# EAGLE design TwoArmedBandit_v1 (EAGLE 9.6.2)
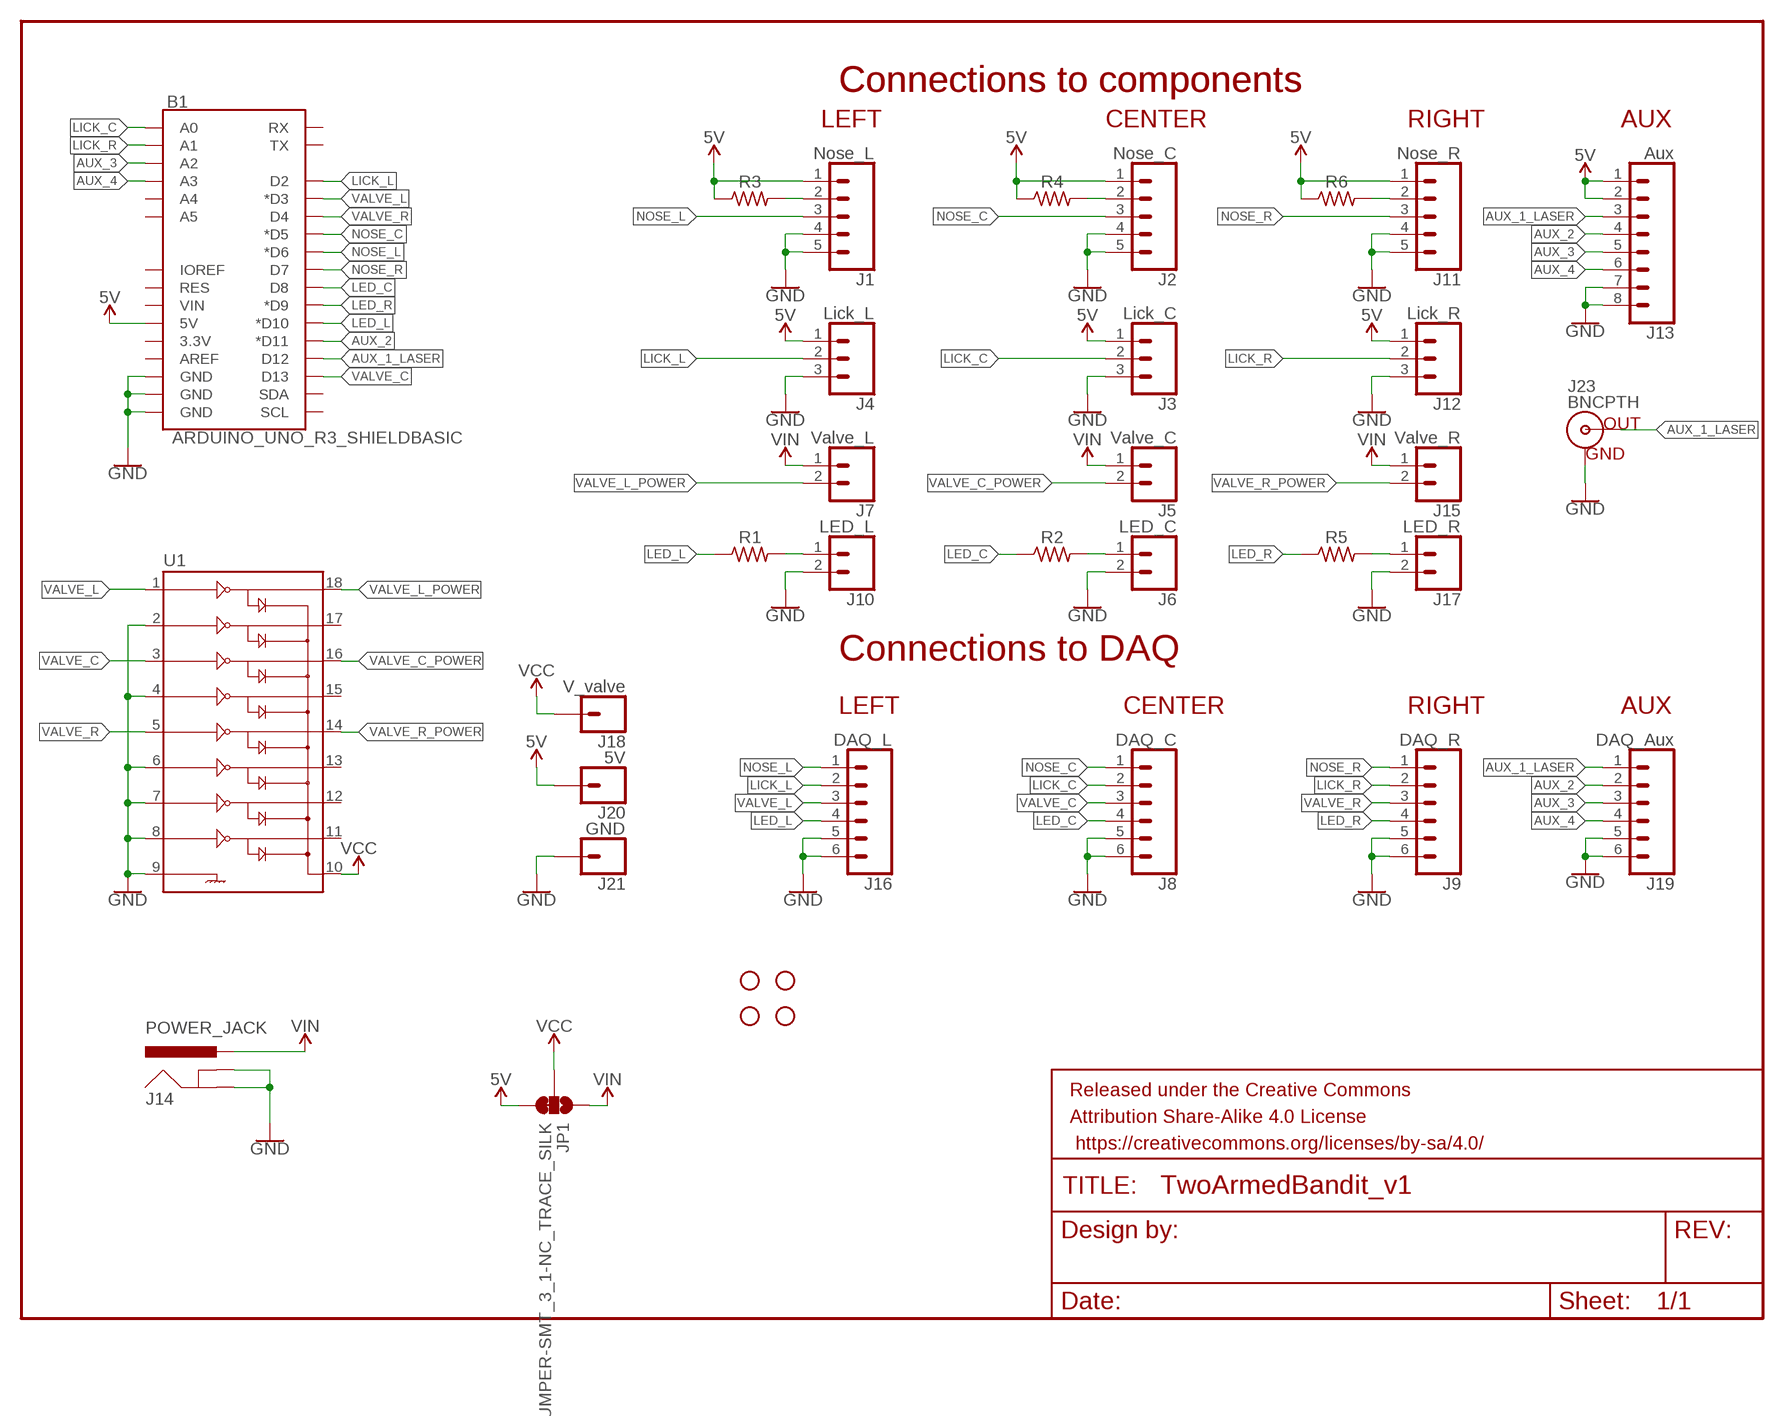
[diagram p0: schematic, sheet 1]

## Parts
B1  ARDUINO_UNO_R3_SHIELDBASIC  [UNO_R3_SHIELD]
FRAME1  FRAME-LETTERNO_PACKAGE  [DUMMY]
H1  STAND-OFF  [STAND-OFF]
H2  STAND-OFF  [STAND-OFF]
H3  STAND-OFF  [STAND-OFF]
H4  STAND-OFF  [STAND-OFF]
J1  Nose_L  CONN_05SCREW  [SCREWTERMINAL-3.5MM-5]
J2  Nose_C  CONN_05SCREW  [SCREWTERMINAL-3.5MM-5]
J3  Lick_C  CONN_03  [1X03]
J4  Lick_L  CONN_03  [1X03]
J5  Valve_C  CONN_02  [1X02]
J6  LED_C  CONN_02  [1X02]
J7  Valve_L  CONN_02  [1X02]
J8  DAQ_C  CONN_063.5MM-6  [SCREWTERMINAL-3.5MM-6]
J9  DAQ_R  CONN_063.5MM-6  [SCREWTERMINAL-3.5MM-6]
J10  LED_L  CONN_02  [1X02]
J11  Nose_R  CONN_05SCREW  [SCREWTERMINAL-3.5MM-5]
J12  Lick_R  CONN_03  [1X03]
J13  Aux  CONN_08"  [1X08]
J14  POWER_JACK  [POWER_JACK_PTH]
J15  Valve_R  CONN_02  [1X02]
J16  DAQ_L  CONN_063.5MM-6  [SCREWTERMINAL-3.5MM-6]
J17  LED_R  CONN_02  [1X02]
J18  V_valve  CONN_01PTH_2MM  [1X01_2MM]
J19  DAQ_Aux  CONN_063.5MM-6  [SCREWTERMINAL-3.5MM-6]
J20  5V  CONN_01PTH_2MM  [1X01_2MM]
J21  GND  CONN_01PTH_2MM  [1X01_2MM]
J23  BNCPTH  [BNC]
JP1  JUMPER-SMT_3_1-NC_TRACE_SILK  [SMT-JUMPER_3_1-NC_TRACE_SILK]
R1  330  R-US_0309/12  [0309/12]
R2  330  R-US_0309/12  [0309/12]
R3  160  R-US_0309/12  [0309/12]
R4  160  R-US_0309/12  [0309/12]
R5  330  R-US_0309/12  [0309/12]
R6  160  R-US_0309/12  [0309/12]
U1  ULN2803DIP  [DIL18]

## Nets
5V [power]: B1.5V J1.1 J2.1 J3.1 J4.1 J11.1 J12.1 J13.1 J13.2 J20.1 JP1.3 R3.1 R4.1 R6.1
AUX_1_LASER: B1.D12 J13.3 J19.1 J23.S(OUT)
AUX_2: B1.D11(*D11) J13.4 J19.2
AUX_3: B1.A2 J13.5 J19.3
AUX_4: B1.A3 J13.6 J19.4
GND [power]: B1.GND@0(GND) B1.GND@1(GND) B1.GND@2(GND) J1.4 J1.5 J2.4 J2.5 J3.3 J4.3 J6.2 J8.5 J8.6 J9.5 J9.6 J10.2 J11.4 J11.5 J12.3 J13.7 J13.8 J14.GND J14.GNDBREAK J16.5 J16.6 J17.2 J19.5 J19.6 J21.1 J23.GND U1.2 U1.4 U1.6 U1.7 U1.8 U1.9
LED_C: B1.D8 J8.4 R2.1
LED_L: B1.D10(*D10) J16.4 R1.1
LED_R: B1.D9(*D9) J9.4 R5.1
LICK_C: B1.A0 J3.2 J8.2
LICK_L: B1.D2 J4.2 J16.2
LICK_R: B1.A1 J9.2 J12.2
N$1: J2.2 R4.2
N$2: J1.2 R3.2
N$3: J6.1 R2.2
N$4: J11.2 R6.2
N$5: J17.1 R5.2
N$11: J10.1 R1.2
NOSE_C: B1.D5(*D5) J2.3 J8.1
NOSE_L: B1.D6(*D6) J1.3 J16.1
NOSE_R: B1.D7 J9.1 J11.3
VALVE_C: B1.D13 J8.3 U1.3
VALVE_C_POWER [power]: J5.2 U1.16
VALVE_L: B1.D3(*D3) J16.3 U1.1
VALVE_L_POWER [power]: J7.2 U1.18
VALVE_R: B1.D4 J9.3 U1.5
VALVE_R_POWER [power]: J15.2 U1.14
VCC [power]: J18.1 JP1.2 U1.10
VIN [power]: J5.1 J7.1 J14.PWR J15.1 JP1.1
Unconnected: B1.3.3V B1.A4 B1.A5 B1.AREF B1.IOREF B1.RES B1.RX B1.SCL B1.SDA B1.TX B1.VIN U1.11 U1.12 U1.13 U1.15 U1.17

## Notes on the sheet
- Connections to components | Connections to components
- LEFT | CENTER | RIGHT | AUX
- Connections to DAQ
- LEFT | CENTER | RIGHT | AUX

## Library data of the parts
B1 = SparkFun-Boards:ARDUINO_UNO_R3_SHIELD: Arduino R3 Shield Footprint Shield form compatible with the Arduino Uno R3. SparkFun Products: MG2639 Cellular Shield <https://www.sparkfun.com/products/13120> MIDI Shield <https://www.sparkfun.com/products/12898> R3 Stackable Headers Kit <https://www.sparkfun.com/products/11417>
FRAME1 = SparkFun-Aesthetics:FRAME-LETTER: Schematic Frame - Letter Standard 8.5x11 US Letter frame; DESIGNER: Nobody; VERSION: v01
H1-H4 = SparkFun-Hardware:STAND-OFF: Stand Off Drill holes for mechanically mounting via screws, standoffs, etc. Note: Use the keepout ring to avoid running the screw head into surrounding components. Variant Overviews STAND-OFF - Mechanical footprint for a #4 phillips button head screw. STAND-OFF-TIGHT - Mechanical footprint for a #4 phillips button head screw, Example SparkFun Products Screw - Phillips Head (1/4", 4-40, 10 pack) <https://www.sparkfun.com/products/10453> (PRT-10453) Screw - Phillips Head (1/2", 4-40, 10 pack) <https://www.sparkfun.com/products/10452> (PRT-10452) Screw - Phillips Head (3/4", 4-40, 10 pack) <https://www.sparkfun.com/products/10451> (PRT-10451) Screw - Phillips Head (1", 4-40, 10 pack) <https://www.sparkfun.com/products/10450> (PRT-10450)
J1 J2 J11 = SparkFun-Connectors:CONN_05: Multi connection point. Often used as Generic Header-pin footprint for 0.1 inch spaced/style header connections On any of the 0.1 inch spaced packages, you can populate with these: Break Away Headers - Straight <https://www.sparkfun.com/products/116> (PRT-00116) Break Away Male Headers - Right Angle <https://www.sparkfun.com/products/553> (PRT-00553) Female Headers <https://www.sparkfun.com/products/115> (PRT-00115) Break Away Headers - Machine Pin <https://www.sparkfun.com/products/117> (PRT-00117) Break Away Female Headers - Swiss Machine Pin <https://www.sparkfun.com/products/743> (PRT-00743) For SCREWTERMINALS and SPRING TERMINALS visit here: Screw Terimnals on SparkFun.com <https://www.sparkfun.com/search/results?term=Screw+Terminals> (5mm/3.5mm/2.54mm spacing) This device is also useful as a general connection point to wire up your design to another part of your project. Our various solder wires solder well into these plated through hole pads. Hook-Up Wire - Assortment (Stranded, 22 AWG) <https://www.sparkfun.com/products/11375> (PRT-11375) Hook-Up Wire - Assortment (Solid Core, 22 AWG) <https://www.sparkfun.com/products/11367> (PRT-11367) View the entire wire category on our website here <https://www.sparkfun.com/categories/141> Special notes: Molex polarized connector foot print use with SKU : PRT-08231 with associated crimp pins and housings. 1MM SMD Version SKU: PRT-10208; PROD_ID: Combine 8288+8399
J3 J4 J12 = SparkFun-Connectors:CONN_03: Multi connection point. Often used as Generic Header-pin footprint for 0.1 inch spaced/style header connections On any of the 0.1 inch spaced packages, you can populate with these: Break Away Headers - Straight <https://www.sparkfun.com/products/116> (PRT-00116) Break Away Male Headers - Right Angle <https://www.sparkfun.com/products/553> (PRT-00553) Female Headers <https://www.sparkfun.com/products/115> (PRT-00115) Break Away Headers - Machine Pin <https://www.sparkfun.com/products/117> (PRT-00117) Break Away Female Headers - Swiss Machine Pin <https://www.sparkfun.com/products/743> (PRT-00743) Stackable Header - 3 Pin (Female, 0.1") <https://www.sparkfun.com/products/13875> (PRT-13875) For SCREWTERMINALS and SPRING TERMINALS visit here: Screw Terimnals on SparkFun.com <https://www.sparkfun.com/search/results?term=Screw+Terminals> (5mm/3.5mm/2.54mm spacing) This device is also useful as a general connection point to wire up your design to another part of your project. Our various solder wires solder well into these plated through hole pads. Hook-Up Wire - Assortment (Stranded, 22 AWG) <https://www.sparkfun.com/products/11375> (PRT-11375) Hook-Up Wire - Assortment (Solid Core, 22 AWG) <https://www.sparkfun.com/products/11367> (PRT-11367) View the entire wire category on our website here <https://www.sparkfun.com/categories/141> Special notes: Molex polarized connector foot print use with SKU : PRT-08232 with associated crimp pins and housings.
J5-J7 J10 J15 J17 = SparkFun-Connectors:CONN_02: Multi connection point. Often used as Generic Header-pin footprint for 0.1 inch spaced/style header connections On any of the 0.1 inch spaced packages, you can populate with these: Break Away Headers - Straight <https://www.sparkfun.com/products/116> (PRT-00116) Break Away Male Headers - Right Angle <https://www.sparkfun.com/products/553> (PRT-00553) Female Headers <https://www.sparkfun.com/products/115> (PRT-00115) Break Away Headers - Machine Pin <https://www.sparkfun.com/products/117> (PRT-00117) Break Away Female Headers - Swiss Machine Pin <https://www.sparkfun.com/products/743> (PRT-00743) For SCREWTERMINALS and SPRING TERMINALS visit here: Screw Terimnals on SparkFun.com <https://www.sparkfun.com/search/results?term=Screw+Terminals> (5mm/3.5mm/2.54mm spacing) This device is also useful as a general connection point to wire up your design to another part of your project. Our various solder wires solder well into these plated through hole pads. Hook-Up Wire - Assortment (Stranded, 22 AWG) <https://www.sparkfun.com/products/11375> (PRT-11375) Hook-Up Wire - Assortment (Solid Core, 22 AWG) <https://www.sparkfun.com/products/11367> (PRT-11367) View the entire wire category on our website here <https://www.sparkfun.com/categories/141> Special notes: Molex polarized connector foot print use with: PRT-08233 with associated crimp pins and housings. 2.54_SCREWTERM for use with PRT-10571. 3.5mm Screw Terminal footprints for PRT-08084 5mm Screw Terminal footprints for use with PRT-08432
J8 J9 J16 J19 = SparkFun-Connectors:CONN_06: Multi connection point. Often used as Generic Header-pin footprint for 0.1 inch spaced/style header connections On any of the 0.1 inch spaced packages, you can populate with these: Break Away Headers - Straight <https://www.sparkfun.com/products/116> (PRT-00116) Break Away Male Headers - Right Angle <https://www.sparkfun.com/products/553> (PRT-00553) Female Headers <https://www.sparkfun.com/products/115> (PRT-00115) Break Away Headers - Machine Pin <https://www.sparkfun.com/products/117> (PRT-00117) Break Away Female Headers - Swiss Machine Pin <https://www.sparkfun.com/products/743> (PRT-00743) Arduino Stackable Header - 6 Pin <https://www.sparkfun.com/products/9280> (PRT-09280) For SCREWTERMINALS and SPRING TERMINALS visit here: Screw Terimnals on SparkFun.com <https://www.sparkfun.com/search/results?term=Screw+Terminals> (5mm/3.5mm/2.54mm spacing) This device is also useful as a general connection point to wire up your design to another part of your project. Our various solder wires solder well into these plated through hole pads. Hook-Up Wire - Assortment (Stranded, 22 AWG) <https://www.sparkfun.com/products/11375> (PRT-11375) Hook-Up Wire - Assortment (Solid Core, 22 AWG) <https://www.sparkfun.com/products/11367> (PRT-11367) View the entire wire category on our website here <https://www.sparkfun.com/categories/141>
J13 = SparkFun-Connectors:CONN_08: Multi connection point. Often used as Generic Header-pin footprint for 0.1 inch spaced/style header connections On any of the 0.1 inch spaced packages, you can populate with these: Break Away Headers - Straight <https://www.sparkfun.com/products/116> (PRT-00116) Break Away Male Headers - Right Angle <https://www.sparkfun.com/products/553> (PRT-00553) Female Headers <https://www.sparkfun.com/products/115> (PRT-00115) Break Away Headers - Machine Pin <https://www.sparkfun.com/products/117> (PRT-00117) Break Away Female Headers - Swiss Machine Pin <https://www.sparkfun.com/products/743> (PRT-00743) Arduino Stackable Header - 8 Pin <https://www.sparkfun.com/products/9279> (PRT-09279) For SCREWTERMINALS and SPRING TERMINALS visit here: Screw Terimnals on SparkFun.com <https://www.sparkfun.com/search/results?term=Screw+Terminals> (5mm/3.5mm/2.54mm spacing) This device is also useful as a general connection point to wire up your design to another part of your project. Our various solder wires solder well into these plated through hole pads. Hook-Up Wire - Assortment (Stranded, 22 AWG) <https://www.sparkfun.com/products/11375> (PRT-11375) Hook-Up Wire - Assortment (Solid Core, 22 AWG) <https://www.sparkfun.com/products/11367> (PRT-11367) View the entire wire category on our website here <https://www.sparkfun.com/categories/141> Special notes: Molex polarized connector foot print use with SKU : PRT-08231 with associated crimp pins and housings. 1MM SMD Version SKU: PRT-10208 NOTES ON THE VARIANTS LOCK and LOCK_LONGPADS... This footprint was designed to help hold the alignment of a through-hole component (i.e. 6-pin header) while soldering it into place. You may notice that each hole has been shifted either up or down by 0.005 of an inch from it's more standard position (which is a perfectly straight line). This slight alteration caused the pins (the squares in the middle) to touch the edges of the holes. Because they are alternating, it causes a "brace" to hold the component in place. 0.005 has proven to be the perfect amount of "off-center" position when using our standard breakaway headers. Although looks a little odd when you look at the bare footprint, once you have a header in there, the alteration is very hard to notice. Also,if you push a header all the way into place, it is covered up entirely on the bottom side.; PROD_ID: CONN-08438
J14 = SparkFun-Connectors:POWER_JACK: Power Jack Connector This is the standard 5.5mm barrel jack for power. The PTH is the most common, proven, reliable, footprint. The Slot footprint only works if the mill layer is transmitted to the PCB fab house so be warned. Here are the connectors we sell at SparkFun: DC Barrel Power Jack/Connector <https://www.sparkfun.com/products/119> (PRT-00119) DC Barrel Power Jack/Connector (SMD) <https://www.sparkfun.com/products/12748> (PRT-12748) DC Barrel Jack Adapter - Breadboard Compatible <https://www.sparkfun.com/products/10811> (PRT-10811) It is used on this SparkFun product (and many, many others): SparkFun RedBoard - Programmed with Arduino <https://www.sparkfun.com/products/12757> (DEV-12757) Also, if you need a mating power supply or connector, please check these out: Wall Adapter Power Supply - 9VDC 650mA <https://www.sparkfun.com/products/298> (TOL-00298) DC Barrel Jack Adapter - Male <https://www.sparkfun.com/products/10287> (PRT-10287); PROD_ID: CONN-08197
J18 J20 J21 = SparkFun-Connectors:CONN_01: Single connection point. Often used as Generic Header-pin footprint for 0.1 inch spaced/style header connections On any of the 0.1 inch spaced packages, you can populate with these: Break Away Headers - Straight <https://www.sparkfun.com/products/116> (PRT-00116) Break Away Male Headers - Right Angle <https://www.sparkfun.com/products/553> (PRT-00553) Female Headers <https://www.sparkfun.com/products/115> (PRT-00115) Break Away Headers - Machine Pin <https://www.sparkfun.com/products/117> (PRT-00117) Break Away Female Headers - Swiss Machine Pin <https://www.sparkfun.com/products/743> (PRT-00743) This device is also useful as a general connection point to wire up your design to another part of your project. Our various solder wires solder well into these plated through hole pads. Hook-Up Wire - Assortment (Stranded, 22 AWG) <https://www.sparkfun.com/products/11375> (PRT-11375) Hook-Up Wire - Assortment (Solid Core, 22 AWG) <https://www.sparkfun.com/products/11367> (PRT-11367) View the entire wire category on our website here <https://www.sparkfun.com/categories/141> Special notes: SMTSO-256-ET is a "flush mount" nut for a 4-40 screw. We mostly use this on specialty testbeds; it is a nice way to connect hardware to your PCB at an adjustable hieght. Also note, the SNAP packages are for using a snappable style connector. We sell a baggie of snaps and they are also used on two LilyPad designs: Snap Assortment - 30 pack (male and female) <https://www.sparkfun.com/products/11347> (DEV-11347) LilyPad Arduino SimpleSnap <https://www.sparkfun.com/products/10941> (DEV-10941) LilyPad SimpleSnap Protoboard <https://www.sparkfun.com/products/10940> (DEV-10940)
J23 = SparkFun-Connectors:BNC: BNC Right Angle Connector Mouser Part# 5227161 SparkFun Products: BNC Connector - Right Angle <https://www.sparkfun.com/products/10550>; PROD_ID: LPA-12729; SF_ID: PRT-10550
JP1 = SparkFun-Jumpers:JUMPER-SMT_3_1-NC_TRACE: Normally closed trace jumper (1 of 2 connections) This jumper has a trace between two pads so it's normally closed (NC). The other connection is normally open (NO). Use a razor knife to open the connection. For best results follow the IPC guidelines for cutting traces: Cutout at least 0.063 mm (0.005 in). Remove all loose material to clean up the cut area. Seal the cut with an approved epoxy. Reapply solder to reclose the connection, or to close the NO connection.
R1-R6 = rcl:R-US_: RESISTOR, American symbol; SPICEPREFIX: R
U1 = SparkFun-IC-Special-Function:ULN2803: Darlington Driver(IC-07959, low stock) ULN2803 Darlington array. 500mA max per channel, 8-channel package. Spark Fun Electronics SKU : COM-00312

## Net classes
0 default: width 0.305 mm
1 power: width 0.61 mm

## Board
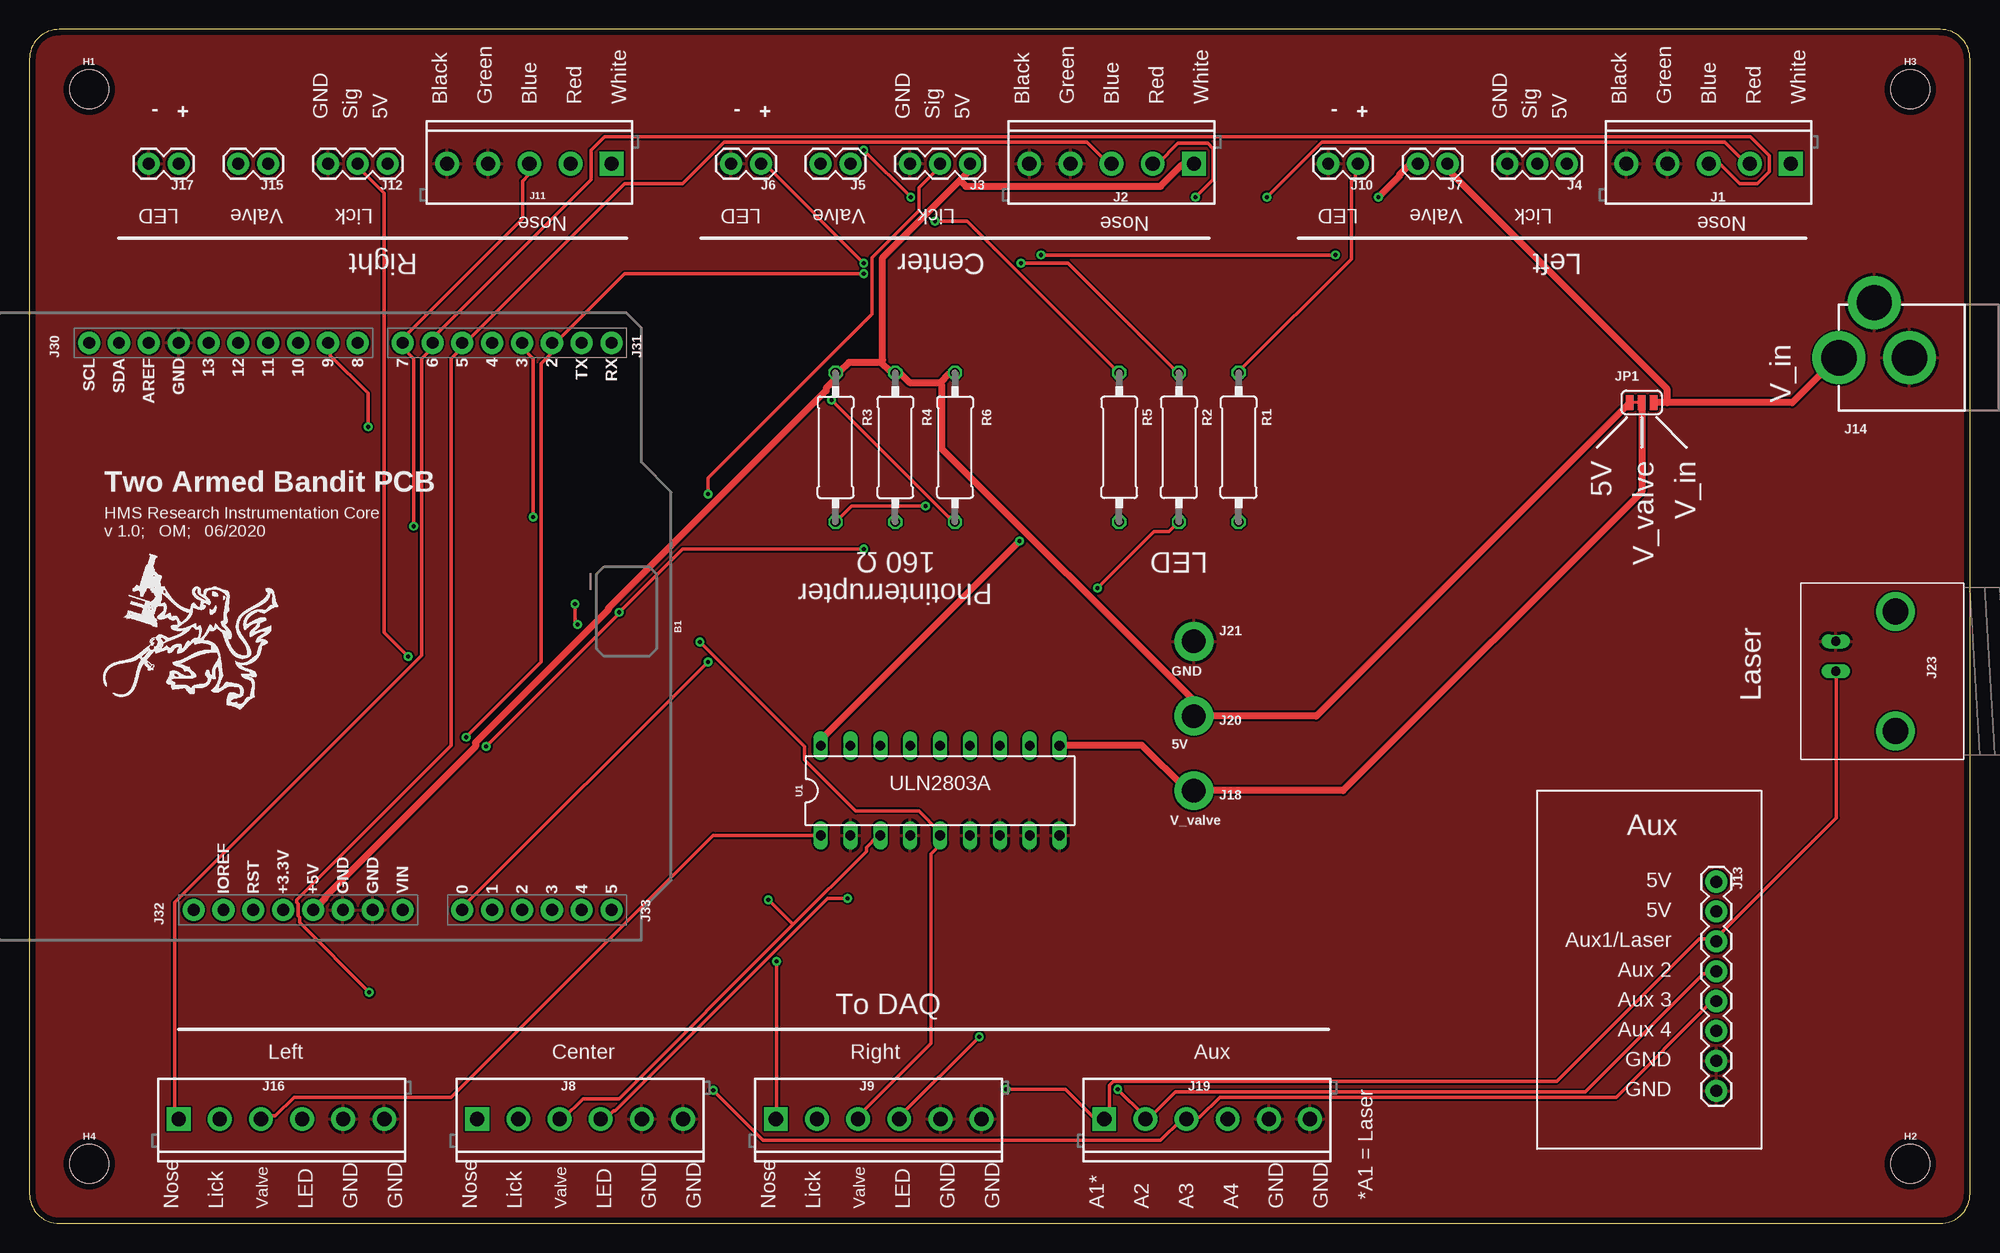
[diagram p1: board, top side]
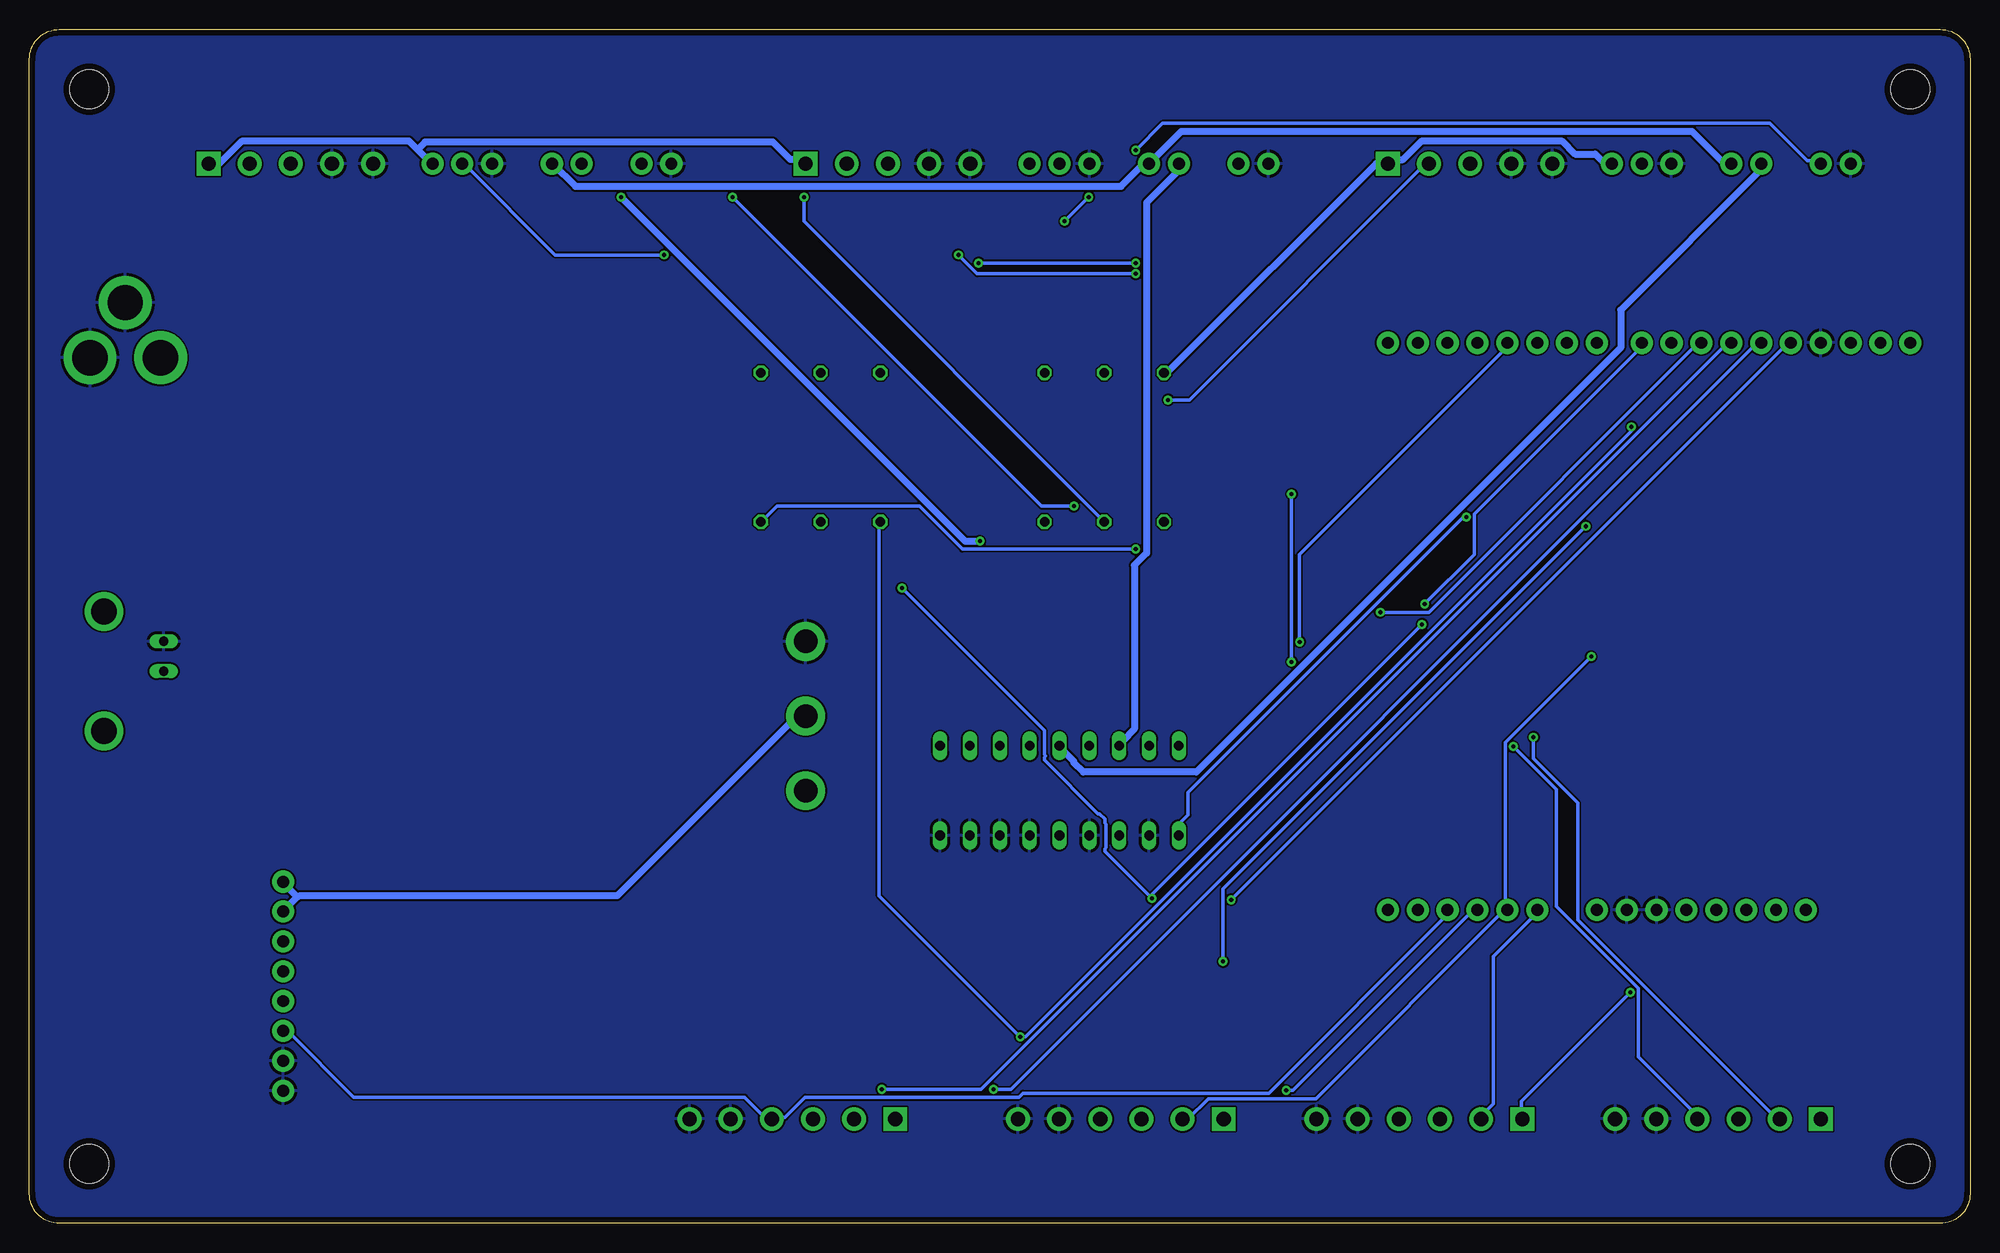
[diagram p2: board, bottom side, seen from below]

Size 165.1 x 101.6 mm. Coordinates in mm from the lower left corner, seen from the top.
Outline: 0,99.06 0,2.54 arc90 2.54,0 162.56,0 arc90 165.1,2.54 165.1,99.06 arc90 162.56,101.6 2.54,101.6 arc90 0,99.06
Copper layers (1*16): Top 0.0178mm / dielectric 59mil / Bottom 0.0178mm
Design rules "SSC-EAGLE-2Lyr_v1.0.0.3 *": minimum track width 6mil, minimum drill 8mil, track to track 6mil, track to pad 6mil, pad to pad 6mil, via to via 6mil, smd to smd 6mil, copper to edge 20mil, drill to drill 16mil, minimum pad ring 8mil, minimum via ring 8mil, stop-mask expansion 3mil, vias tented up to drill 0mil, thermal gap 10mil

### Footprints (pad centres in the part's own frame; a part is rotated, then mirrored left to right if it is on the bottom)
UNO_R3_SHIELD = drill 1.016 pad 1.88: 3.3V 24.13,-2.54; 5V 24.13,0; A0 24.13,12.7; A1 24.13,15.24; A2 24.13,17.78; A3 24.13,20.32; A4 24.13,22.86; A5 24.13,25.4; AREF -24.13,-13.97; D2 -24.13,20.32; D3 -24.13,17.78; D4 -24.13,15.24; D5 -24.13,12.7; D6 -24.13,10.16; D7 -24.13,7.62; D8 -24.13,3.81; D9 -24.13,1.27; D10 -24.13,-1.27; D11 -24.13,-3.81; D12 -24.13,-6.35; D13 -24.13,-8.89; GND@0 24.13,2.54; GND@1 24.13,5.08; GND@2 -24.13,-11.43; IOREF 24.13,-7.62; NC 24.13,-10.16; RES 24.13,-5.08; RX -24.13,25.4; SCL -24.13,-19.05; SDA -24.13,-16.51; TX -24.13,22.86; VIN 24.13,7.62
STAND-OFF = hole 3.302: 0,0
SCREWTERMINAL-3.5MM-5 = drill 1.2 pad 2.032 square: 1 0,0 | drill 1.2 pad 2.032: 2 3.5,0; 3 7,0; 4 10.5,0; 5 14,0
1X03 = drill 1.016 pad 1.88: 1 0,0; 2 2.54,0; 3 5.08,0
1X02 = drill 1.016 pad 1.88: 1 0,0; 2 2.54,0
SCREWTERMINAL-3.5MM-6 = drill 1.2 pad 2.032 square: 1 0,0 | drill 1.2 pad 2.032: 2 3.5,0; 3 7,0; 4 10.5,0; 5 14,0; 6 17.5,0
1X08 = drill 1.016 pad 1.88: 1 0,0; 2 2.54,0; 3 5.08,0; 4 7.62,0; 5 10.16,0; 6 12.7,0; 7 15.24,0; 8 17.78,0
POWER_JACK_PTH = drill 2.997 pad 4.318: GND 0,7.7; GNDBREAK 4.7,10.7; PWR 0,13.7
1X01_2MM = drill 2 pad 3.302: 1 0,0
BNC = drill 2.2: 3 -5.08,5.08; 4 5.08,5.08 | drill 0.8 long: GND -2.54,0; S 0,0
SMT-JUMPER_3_1-NC_TRACE_SILK = smd 0.635 x 1.27: 1 -1.016,0; 2 0,0; 3 1.016,0
0309/12 = drill 0.813 octagon: 1 -6.35,0; 2 6.35,0
DIL18 = drill 0.813 long: 1 -10.16,-3.81; 2 -7.62,-3.81; 3 -5.08,-3.81; 4 -2.54,-3.81; 5 0,-3.81; 6 2.54,-3.81; 7 5.08,-3.81; 8 7.62,-3.81; 9 10.16,-3.81; 10 10.16,3.81; 11 7.62,3.81; 12 5.08,3.81; 13 2.54,3.81; 14 0,3.81; 15 -2.54,3.81; 16 -5.08,3.81; 17 -7.62,3.81; 18 -10.16,3.81

### Placement (x,y rotation side)
B1  24.13,50.8 270 top
FRAME1  -5.08,-2.54 180 top  (outside the outline)
H1  5.08,96.52 0 top
H2  160.02,5.08 0 top
H3  160.02,96.52 0 top
H4  5.08,5.08 0 top
J1  149.86,90.17 180 top
J2  99.06,90.17 180 top
J3  80.01,90.17 180 top
J4  130.81,90.17 180 top
J5  69.85,90.17 180 top
J6  62.23,90.17 180 top
J7  120.65,90.17 180 top
J8  38.1,8.89 0 top
J9  63.5,8.89 0 top
J10  113.03,90.17 180 top
J11  49.53,90.17 180 top
J12  30.48,90.17 180 top
J13  143.51,29.08 270 top
J14  167.64,73.66 90 top
J15  20.32,90.17 180 top
J16  12.7,8.89 0 top
J17  12.7,90.17 180 top
J18  99.06,36.83 0 top
J19  91.44,8.89 0 top
J20  99.06,43.18 0 top
J21  99.06,49.53 0 top
J23  153.67,46.99 270 top
JP1  137.16,69.85 180 top
R1  102.87,66.04 90 top
R2  97.79,66.04 90 top
R3  68.58,66.04 270 top
R4  73.66,66.04 270 top
R5  92.71,66.04 90 top
R6  78.74,66.04 270 top
U1  77.47,36.83 0 top
U$1  [RIC_LOGO_BIG]  13.97,49.53 0 top

### Tracks (layer width: path | path; a pad name or v marks a point on that pad's centre or on a via)
5V
  Top 0.61: 72.47,73.27 69.72,73.27 68.92,72.47 68.58,72.47 R3.1 68.92,72.24 67.78,71.09 67.78,70.87 49.26,52.35 49.26,52.23 37.95,40.92 37.95,40.58 25.15,27.77 25.15,27.66 24.23,26.75 B1.5V | 72.47,73.27 73.27,72.47 73.61,72.47 R4.1 73.84,72.24 73.95,72.24 74.07,72.35 74.87,71.55 77.5,71.55 | 77.5,71.55 78.3,72.35 78.64,72.35 R6.1 | J3.1 80.01,89.61 79.15,88.75 | 79.15,88.75 72.58,82.18 72.58,73.5 72.47,73.27 | 79.15,88.75 79.67,88.24 96.24,88.24 98.07,90.07 98.98,90.07 J2.1 | 77.5,71.55 77.61,71.32 77.61,65.95 98.98,44.58 98.98,43.43 J20.1 109.47,43.18 119.51,53.21 JP1.3
  Bottom 0.61: 142.3,27.77 143.45,26.63 J13.2 | 142.3,27.77 143.56,29.03 J13.1 | 142.3,27.77 142.07,27.89 115.1,27.89 99.9,43.09 99.1,43.09 J20.1 | 132.07,91.38 132.82,92.13 146.99,92.13 149.05,90.07 149.85,90.07 J1.1 | 132.07,91.38 130.87,90.18 J4.1 | J12.1 30.52,90.18 31.09,90.18 31.89,90.98 33.6,90.98 34.75,92.13 46.63,92.13 48.23,90.53 49.15,90.53 49.49,90.18 J11.1 49.84,90.18 50.52,90.18 68.24,72.47 68.58,72.47 R3.1 | 132.07,91.38 131.44,92.01 101.84,92.01 100.36,90.53 99.44,90.53 99.1,90.18 J2.1
AUX_1_LASER  (via drill 0.35)
  Top 0.305: J23.S 153.73,46.98 153.73,34.52 143.56,24.35 143.56,24 J13.3 143.45,24.23 142.07,24.23 129.96,12.12 92.24,12.12 91.9,11.77 91.9,9.49 91.44,9.03 J19.1 91.44,8.91 90.64,8.91 88.12,11.43 v83.1,11.43
  Bottom 0.305: v83.1,11.43 81.61,11.43 18.17,74.87 17.83,74.87 B1.D12
AUX_2  (via drill 0.35)
  Top 0.305: v92.58,11.43 94.87,9.14 94.87,8.91 J19.2 94.98,9.14 95.44,9.14 97.5,11.2 132.36,11.2 142.42,21.26 142.53,21.26 142.65,21.37 143.45,21.37 J13.4
  Bottom 0.305: v92.58,11.43 84.12,11.43 20.69,74.87 20.34,74.87 B1.D11
AUX_3  (via drill 0.35)
  Top 0.305: v58.18,11.32 62.41,7.09 96.24,7.09 97.95,8.8 98.41,8.8 J19.3 98.53,8.91 99.33,8.91 99.44,9.03 99.56,9.03 101.27,10.74 134.99,10.74 143.1,18.86 143.45,18.86 J13.5
  Bottom 0.305: v58.18,11.32 57.61,11.32 42.29,26.63 41.95,26.63 B1.A2
AUX_4
  Bottom 0.305: B1.A3 44.46,26.63 44.46,26.29 59.66,11.09 80.58,11.09 80.92,10.74 99.1,10.74 100.81,9.03 100.93,9.03 101.04,8.91 101.84,8.91 J19.4 102.07,8.91 102.41,8.91 104.24,10.74 137.5,10.74 143.1,16.34 143.45,16.34 J13.6
GND
  pour Top: 2.54,0 162.56,0 arc90 165.1,2.54 165.1,99.06 arc90 162.56,101.6 2.54,101.6 arc90 0,99.06 0,2.54 arc90
  pour Bottom: 2.54,0 162.56,0 arc90 165.1,2.54 165.1,99.06 arc90 162.56,101.6 2.54,101.6 arc90 0,99.06 0,2.54 arc90
LED_C  (via drill 0.35)
  Top 0.305: v90.87,54.06 95.67,58.86 96.93,58.86 97.73,59.66 R2.1 | v69.61,27.66 67.89,27.66 49.84,9.6 49.72,9.6 49.03,8.91 48.69,8.91 J8.4 | v46.41,52.69 46.41,51.21 v46.63,50.98
  Bottom 0.305: v90.87,54.06 78.75,41.95 78.75,39.89 78.64,39.78 78.75,39.66 78.75,39.43 74.18,34.86 74.07,34.86 73.61,34.4 73.61,34.06 73.5,33.95 73.5,32 73.61,31.89 73.61,31.66 v69.61,27.66 69.72,27.89 v46.63,50.98 | v46.41,52.69 42.18,56.92 42.18,60.35 28,74.52 28,74.87 B1.D8
LED_L  (via drill 0.35)
  Top 0.305: v70.98,57.38 55.55,57.38 v50.18,52.01 50.18,51.89 v38.86,40.58
  Bottom 0.305: v70.98,57.38 85.72,57.38 89.38,61.04 101.5,61.04 102.53,60.01 102.64,60.01 102.87,59.78 R1.1 | v50.18,52.01 46.06,52.01 23.2,74.87 22.86,74.87 B1.D10 | v38.86,40.58 35.2,36.92 35.2,26.98 28.23,20 28.23,14.17 23.2,9.14 23.2,8.91 J16.4
LED_R  (via drill 0.35)
  Top 0.305: v80.81,15.89 74.07,9.14 74.07,8.91 J9.4 | v28.8,67.78 28.8,70.64 25.6,73.84 25.6,73.95 25.49,74.07 25.49,74.87 B1.D9
  Bottom 0.305: R5.1 92.81,59.66 92.81,27.89 v80.81,15.89 80.35,15.89 28.8,67.44 v28.8,67.78
LICK_C  (via drill 0.35)
  Top 0.305: v57.72,62.06 57.72,63.44 71.67,77.38 71.67,82.18 75.67,86.18 75.67,88.12 77.38,89.84 77.38,90.07 J3.2 | v57.72,47.78 36.92,26.98 36.92,26.75 B1.A0
  Bottom 0.305: B1.A0 36.92,26.63 36.92,26.4 40.58,22.75 40.58,10.17 41.49,9.26 41.49,8.91 J8.2 | v57.72,47.78 v57.72,62.06
LICK_L  (via drill 0.35)
  Top 0.305: v37.15,41.38 43.55,47.78 43.55,73.15 44.35,73.95 44.35,74.87 B1.D2 44.58,74.98 44.81,74.98 50.63,80.81 v70.98,80.81 | v86.07,82.41 v111.1,82.41
  Bottom 0.305: v37.15,41.38 37.15,39.55 33.38,35.78 33.38,25.83 16.46,8.91 16.23,8.91 J16.2 | v111.1,82.41 120.36,82.41 128.02,90.07 128.25,90.07 J4.2 | v86.07,82.41 84.47,80.81 v70.98,80.81
LICK_R  (via drill 0.35)
  Top 0.305: v32.23,48.23 30.18,50.29 30.18,87.67 28,89.84 28,90.07 J12.2
  Bottom 0.305: J9.2 66.98,8.91 66.52,8.91 64.81,10.63 55.66,10.63 39.66,26.63 39.43,26.63 B1.A1 39.55,26.75 39.55,40.92 v32.23,48.23
N$1  (via drill 0.35)
  Top 0.305: v99.21,87.33 100.7,88.81 100.7,91.44 100.24,91.9 97.73,91.9 96.01,90.18 95.67,90.18 J2.2
  Bottom 0.305: v99.21,87.33 99.21,85.27 73.72,59.78 R4.2
N$2  (via drill 0.35)
  Top 0.305: v76.24,61.04 69.95,61.04 68.92,60.01 68.81,60.01 68.58,59.78 R3.2 | v105.27,87.33 109.96,92.01 144.25,92.01 146.07,90.18 146.3,90.18 J1.2
  Bottom 0.305: v76.24,61.04 78.98,61.04 v105.27,87.33
N$3  (via drill 0.35)
  Top 0.305: v84.35,81.72 88.35,81.72 97.38,72.69 97.5,72.69 97.73,72.47 R2.2 | v70.98,81.72 62.64,90.07 62.29,90.07 J6.1
  Bottom 0.305: v70.98,81.72 v84.35,81.72
N$4  (via drill 0.35)
  Top 0.305: v68.24,70.07 78.18,60.12 78.3,60.12 78.64,59.78 R6.2
  Bottom 0.305: v68.24,70.07 66.41,70.07 46.41,90.07 46.06,90.07 J11.2
N$5  (via drill 0.35)
  Top 0.305: v77.04,85.27 79.78,85.27 92.35,72.69 92.47,72.69 92.7,72.47 R5.2 | v70.98,91.33 v74.98,87.33
  Bottom 0.305: v74.98,87.33 v77.04,85.27 | v70.98,91.33 68.69,93.61 17.03,93.61 13.83,90.41 13.6,90.41 13.37,90.18 12.8,90.18 J17.1
N$11
  Top 0.305: R1.2 102.87,72.47 112.47,82.07 112.47,88.7 112.81,89.04 112.81,89.27 112.93,89.38 112.93,90.07 J10.1
NOSE_C  (via drill 0.35)
  Top 0.305: J2.3 92.01,90.18 91.78,90.18 89.95,92.01 59.09,92.01 55.55,88.47 50.63,88.47 37.15,74.98 36.92,74.98 B1.D5 36.8,74.87 36.8,74.52 35.89,73.61 35.89,40.69 22.75,27.55 22.75,27.32 22.86,27.2 22.86,26.18 22.97,26.06 22.97,25.6 v28.92,19.66
  Bottom 0.305: v28.92,19.66 38.18,10.4 38.18,8.91 J8.1
NOSE_L
  Top 0.305: J16.1 12.69,8.91 12.34,9.26 12.34,27.32 33.38,48.35 33.38,73.61 34.29,74.52 B1.D6 34.4,74.98 34.4,75.44 47.78,88.81 47.78,91.33 48.92,92.47 146.42,92.47 148.02,90.87 148.02,89.5 146.99,88.47 145.5,88.47 143.79,90.18 142.88,90.18 J1.3
NOSE_R  (via drill 0.35)
  Top 0.305: J11.3 42.52,90.07 42.52,89.27 41.95,88.7 41.95,85.5 31.77,75.32 31.77,74.98 B1.D7 31.77,74.87 31.77,74.52 32.69,73.61 v32.69,59.32 | v63.55,22.29 63.55,8.91 J9.1
  Bottom 0.305: v63.55,22.29 63.55,28.46 v32.69,59.32
VALVE_C  (via drill 0.35)
  Top 0.305: 64.98,25.43 50.18,10.63 47.09,10.63 45.38,8.91 45.15,8.91 J8.3 | 64.98,25.43 71.21,31.66 71.21,32 72.12,32.92 72.35,32.92 U1.3 | 64.98,25.43 v62.87,27.55
  Bottom 0.305: v62.87,27.55 15.54,74.87 15.32,74.87 B1.D13
VALVE_C_POWER
  Bottom 0.61: U1.16 72.35,40.69 72.12,40.92 72.12,41.03 71.09,42.06 71.09,56.01 70.07,57.04 70.07,86.87 67.32,89.61 67.32,90.07 J5.2
VALVE_L  (via drill 0.35)
  Top 0.305: U1.1 67.21,33.03 58.18,33.03 35.89,10.74 22.52,10.74 20.92,9.14 20.69,9.14 20.46,8.91 19.77,8.91 J16.3 | v42.86,60.12 42.86,73.61 41.95,74.52 41.95,74.87 B1.D3
  Bottom 0.305: v42.86,60.12 43.09,60.12 66.52,36.69 66.52,34.75 67.21,34.06 67.21,33.03 U1.1
VALVE_L_POWER  (via drill 0.35)
  Top 0.61: v84.24,58.06 67.32,41.15 67.32,40.69 U1.18 | v114.76,87.33 116.59,89.15 116.59,89.27 117.39,90.07 118.07,90.07 J7.2
  Bottom 0.61: v84.24,58.06 85.5,58.06 v114.76,87.33
VALVE_R  (via drill 0.35)
  Top 0.305: J9.3 70.52,8.91 70.52,9.14 76.69,15.32 76.69,31.43 77.38,32.12 77.38,32.92 U1.5 77.38,33.15 77.38,33.38 75.67,35.09 70.29,35.09 65.95,39.43 65.95,40.58 v57.04,49.49
  Bottom 0.305: v57.04,49.49 57.04,56.92 39.43,74.52 39.43,74.87 B1.D4
VALVE_R_POWER
  Bottom 0.61: U1.14 77.38,40.58 77.15,40.35 77.15,40.23 76.24,39.32 76.24,39.2 75.44,38.41 65.84,38.41 29.72,74.52 29.72,77.72 17.83,89.61 17.83,90.07 J15.2
VCC
  Top 0.61: 98.98,36.92 98.41,36.92 94.64,40.69 87.67,40.69 U1.10 | 98.98,36.92 J18.1 | JP1.2 137.16,62.23 111.76,36.83 99.07,36.83 98.98,36.92
VIN
  Top 0.61: 139.33,69.84 149.96,69.84 153.85,73.72 J14.PWR | 139.33,69.84 138.19,69.84 JP1.1 | 139.33,69.84 139.33,70.98 120.7,89.61 120.7,90.07 J7.1
  Bottom 0.61: J15.1 20.34,90.18 20.92,90.18 23.66,92.93 67.09,92.93 J5.1 70.07,90.07 70.41,90.07 72.24,88.24 118.64,88.24 120.59,90.18 J7.1

### Text on the board
tPlace: + - | Black | Green | Blue | Red | White | + - | Black | Green | Blue | Red | White | + - | Black | Green | Blue | Red | White | GND | Sig | 5V | GND | Sig | 5V | GND | Sig | 5V | LED | Valve | Lick | Nose | LED | Valve | Lick | Nose | LED | Valve | Lick | Nose | Right | Center | Left | J30 | J31 | V_in | 5V / V_valve / V_in | Two Armed Bandit PCB | HMS Research Instrumentation Core / v 1.0; OM; 06/2020 | Photinterrupter / 160 Ω | LED | Laser | ULN2803A | Aux | 5V | 5V | J33 | J32 | Aux1/Laser | Aux 2 | Aux 3 | To DAQ | Aux 4 | GND | Left | Center | Right | Aux | GND | *A1 = Laser | Nose | Lick | Valve | LED | GND | GND | Nose | Lick | Valve | LED | GND | GND | Nose | Lick | Valve | LED | GND | GND | A1* | A2 | A3 | A4 | GND | GND